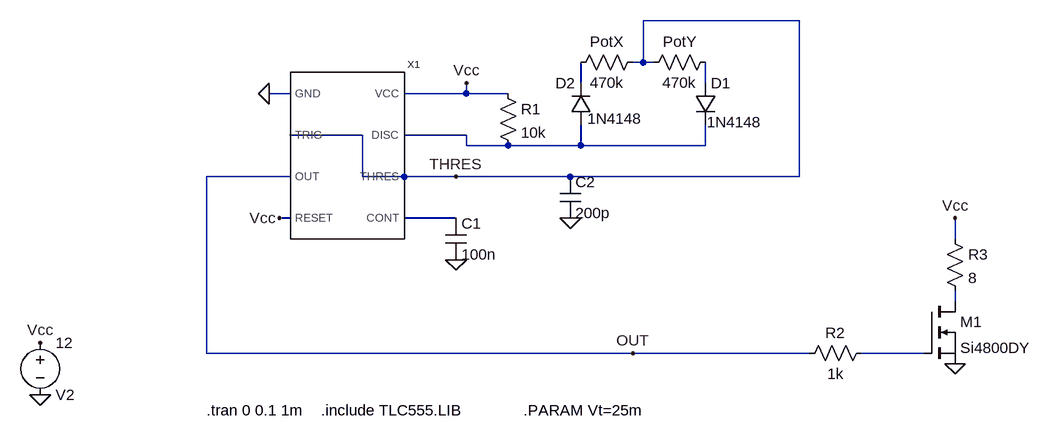
[diagram p0: schematic SchematicSim.asc]
SchematicSim.asc, the LTspice schematic file:
Version 4
SHEET 1 880 680
WIRE 192 -304 -48 -304
WIRE -48 -240 -48 -304
WIRE -48 -240 -64 -240
WIRE -32 -240 -48 -240
WIRE -144 -208 -144 -240
WIRE 48 -208 48 -240
WIRE -592 -192 -624 -192
WIRE -320 -192 -320 -208
WIRE -320 -192 -416 -192
WIRE -256 -192 -320 -192
WIRE -480 -128 -592 -128
WIRE -320 -128 -416 -128
WIRE -320 -112 -320 -128
WIRE -256 -112 -320 -112
WIRE -144 -112 -144 -144
WIRE -144 -112 -256 -112
WIRE 48 -112 48 -144
WIRE 48 -112 -144 -112
WIRE -592 -64 -720 -64
WIRE -480 -64 -480 -128
WIRE -416 -64 -480 -64
WIRE -336 -64 -416 -64
WIRE -160 -64 -336 -64
WIRE 192 -64 192 -304
WIRE 192 -64 -160 -64
WIRE -592 0 -608 0
WIRE -336 0 -416 0
WIRE 432 32 432 0
WIRE 432 128 432 112
WIRE -720 208 -720 -64
WIRE -64 208 -720 208
WIRE 208 208 -64 208
WIRE 384 208 288 208
FLAG 432 224 0
FLAG -624 -192 0
FLAG -336 64 0
FLAG -608 0 Vcc
FLAG -320 -208 Vcc
FLAG -160 0 0
FLAG -64 208 OUT
FLAG -336 -64 THRES
FLAG -976 272 0
FLAG -976 192 Vcc
FLAG 432 0 Vcc
SYMBOL nmos 384 128 R0
SYMATTR InstName M1
SYMATTR Value Si4800DY
SYMBOL res 416 16 R0
SYMATTR InstName R3
SYMATTR Value 8
SYMBOL cap -352 0 R0
SYMATTR InstName C1
SYMATTR Value 100n
SYMBOL res -272 -208 R0
SYMATTR InstName R1
SYMATTR Value 10k
SYMBOL res -48 -256 R90
WINDOW 0 0 56 VBottom 2
WINDOW 3 32 56 VTop 2
SYMATTR InstName PotX
SYMATTR Value 470k
SYMBOL res 64 -256 R90
WINDOW 0 0 56 VBottom 2
WINDOW 3 32 56 VTop 2
SYMATTR InstName PotY
SYMATTR Value 470k
SYMBOL diode 32 -208 R0
WINDOW 3 18 60 Left 2
SYMATTR Value 1N4148
SYMATTR InstName D1
SYMBOL diode -128 -144 R180
WINDOW 0 24 64 Left 2
WINDOW 3 -79 9 Left 2
SYMATTR InstName D2
SYMATTR Value 1N4148
SYMBOL cap -176 -64 R0
SYMATTR InstName C2
SYMATTR Value 200p
SYMBOL TLC555 -448 -128 R0
SYMATTR InstName X1
SYMATTR Prefix X
SYMATTR Value TLC555
SYMBOL res 304 192 R90
WINDOW 0 0 56 VBottom 2
WINDOW 3 32 56 VTop 2
SYMATTR InstName R2
SYMATTR Value 1k
SYMBOL voltage -976 176 R0
WINDOW 0 24 96 Left 2
WINDOW 3 24 16 Left 2
WINDOW 123 0 0 Left 0
WINDOW 39 0 0 Left 0
SYMATTR InstName V2
SYMATTR Value 12
TEXT -720 296 Left 2 !.tran 0 0.1 1m
TEXT -544 296 Left 2 !.include TLC555.LIB
TEXT -232 296 Left 2 !.PARAM Vt=25m

The netlist it stands for:
* SchematicSim.asc
M1 N005 N006 0 0 Si4800DY
R3 Vcc N005 8
C1 N004 0 100n
R1 Vcc N003 10k
R§PotX THRES N001 470k
R§PotY N002 THRES 470k
D1 N002 N003 1N4148
D2 N003 N001 1N4148
C2 THRES 0 200p
XX1 THRES N004 THRES Vcc OUT N003 Vcc 0 TLC555 params: TLC555  ; pins THRES CONT TRIG RESET OUT DISC VCC GND
R2 N006 OUT 1k
V2 Vcc 0 12
.model D D
.lib standard.dio
.model NMOS NMOS
.model PMOS PMOS
.lib standard.mos
.tran 0 0.1 1m
.include TLC555.LIB
.PARAM Vt=25m
.backanno
.end